# EAGLE schematic LEDCube (EAGLE 7.2.0)
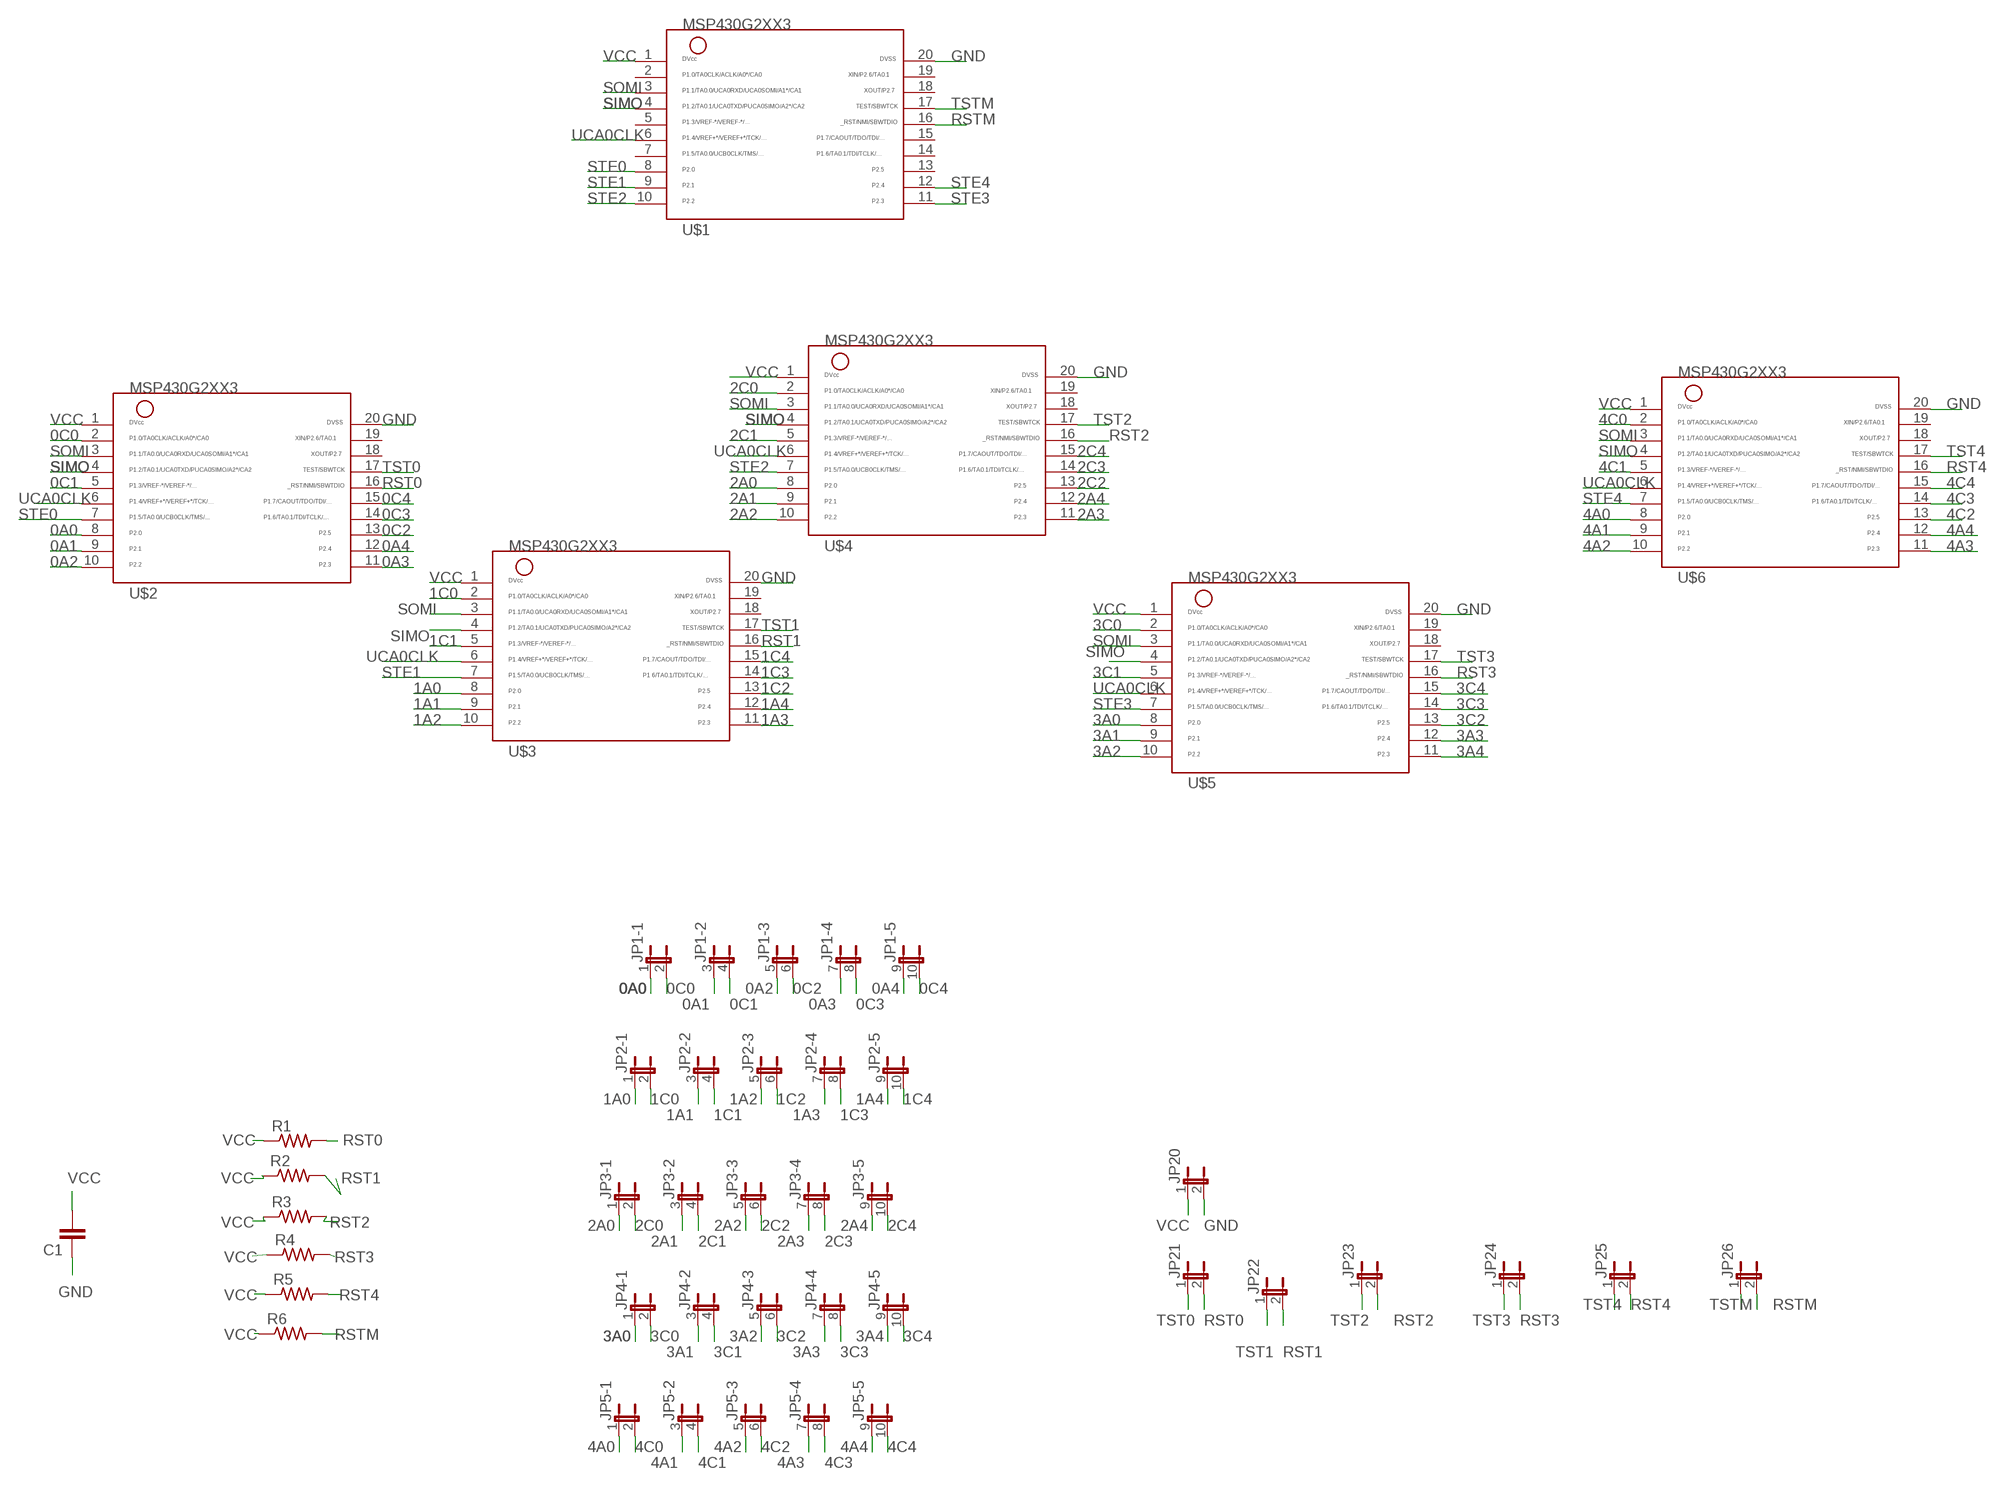
[diagram p0: schematic, sheet 1]

## Parts
C1  CC1206  [C1206]
JP1  JP5QE  [JP5Q]
JP2  JP5QE  [JP5Q]
JP3  JP5QE  [JP5Q]
JP4  JP5QE  [JP5Q]
JP5  JP5QE  [JP5Q]
JP20  JP1E  [JP1]
JP21  JP1E  [JP1]
JP22  JP1E  [JP1]
JP23  JP1E  [JP1]
JP24  JP1E  [JP1]
JP25  JP1E  [JP1]
JP26  JP1E  [JP1]
R1  R-US_R1206  [R1206]
R2  R-US_R1206  [R1206]
R3  R-US_R1206  [R1206]
R4  R-US_R1206  [R1206]
R5  R-US_R1206  [R1206]
R6  R-US_R1206  [R1206]
U$1  MSP430G2XX3TSSOP  [PW20]
U$2  MSP430G2XX3TSSOP  [PW20]
U$3  MSP430G2XX3TSSOP  [PW20]
U$4  MSP430G2XX3TSSOP  [PW20]
U$5  MSP430G2XX3TSSOP  [PW20]
U$6  MSP430G2XX3TSSOP  [PW20]

## Nets
0A0: JP1.1 U$2.8
0A1: JP1.3 U$2.9
0A2: JP1.5 U$2.10
0A3: JP1.7 U$2.11
0A4: JP1.9 U$2.12
0C0: JP1.2 U$2.2
0C1: JP1.4 U$2.5
0C2: JP1.6 U$2.13
0C3: JP1.8 U$2.14
0C4: JP1.10 U$2.15
1A0: JP2.1 U$3.8
1A1: JP2.3 U$3.9
1A2: JP2.5 U$3.10
1A3: JP2.7 U$3.11
1A4: JP2.9 U$3.12
1C0: JP2.2 U$3.2
1C1: JP2.4 U$3.5
1C2: JP2.6 U$3.13
1C3: JP2.8 U$3.14
1C4: JP2.10 U$3.15
2A0: JP3.1 U$4.8
2A1: JP3.3 U$4.9
2A2: JP3.5 U$4.10
2A3: JP3.7 U$4.11
2A4: JP3.9 U$4.12
2C0: JP3.2 U$4.2
2C1: JP3.4 U$4.5
2C2: JP3.6 U$4.13
2C3: JP3.8 U$4.14
2C4: JP3.10 U$4.15
3A0: JP4.1 U$5.8
3A1: JP4.3 U$5.9
3A2: JP4.5 U$5.10
3A3: JP4.7 U$5.12
3A4: JP4.9 U$5.11
3C0: JP4.2 U$5.2
3C1: JP4.4 U$5.5
3C2: JP4.6 U$5.13
3C3: JP4.8 U$5.14
3C4: JP4.10 U$5.15
4A0: JP5.1 U$6.8
4A1: JP5.3 U$6.9
4A2: JP5.5 U$6.10
4A3: JP5.7 U$6.11
4A4: JP5.9 U$6.12
4C0: JP5.2 U$6.2
4C1: JP5.4 U$6.5
4C2: JP5.6 U$6.13
4C3: JP5.8 U$6.14
4C4: JP5.10 U$6.15
GND: C1.1 JP20.2 U$1.20 U$2.20 U$3.20 U$4.20 U$5.20 U$6.20
RST0: JP21.2 R1.2 U$2.16
RST1: JP22.2 R2.2 U$3.16
RST2: JP23.2 R3.2 U$4.16
RST3: JP24.2 R4.2 U$5.16
RST4: JP25.2 R5.2 U$6.16
RSTM: JP26.2 R6.2 U$1.16
SIMO: U$1.4 U$2.4 U$3.4 U$4.4 U$5.4 U$6.4
SOMI: U$1.3 U$2.3 U$3.3 U$4.3 U$5.3 U$6.3
STE0: U$1.8 U$2.7
STE1: U$1.9 U$3.7
STE2: U$1.10 U$4.7
STE3: U$1.11 U$5.7
STE4: U$1.12 U$6.7
TST0: JP21.1 U$2.17
TST1: JP22.1 U$3.17
TST2: JP23.1 U$4.17
TST3: JP24.1 U$5.17
TST4: JP25.1 U$6.17
TSTM: JP26.1 U$1.17
UCA0CLK: U$1.6 U$2.6 U$3.6 U$4.6 U$5.6 U$6.6
VCC: C1.2 JP20.1 R1.1 R2.1 R3.1 R4.1 R5.1 R6.1 U$1.1 U$2.1 U$3.1 U$4.1 U$5.1 U$6.1
Unconnected: U$1.2 U$1.5 U$1.7 U$1.13 U$1.14 U$1.15 U$1.18 U$1.19 U$2.18 U$2.19 U$3.18 U$3.19 U$4.18 U$4.19 U$5.18 U$5.19 U$6.18 U$6.19

## Library data of the parts
C1 = eagle-ltspice:C: CAPACITOR, European symbol; SPICEMODEL: NONE; SPICEPREFIX: C
JP1-JP5 = jumper:JP5QE: JUMPER
JP20-JP26 = jumper:JP1E: JUMPER
R1-R6 = rcl:R-US_: RESISTOR, American symbol
U$1-U$6 = ELEC327:MSP430G2XX3: MSP430G2XX3 PDIP (N) 20 Pin Package